# Altium schematic sheet analogPath.SchDoc
size 381 x 203 mm
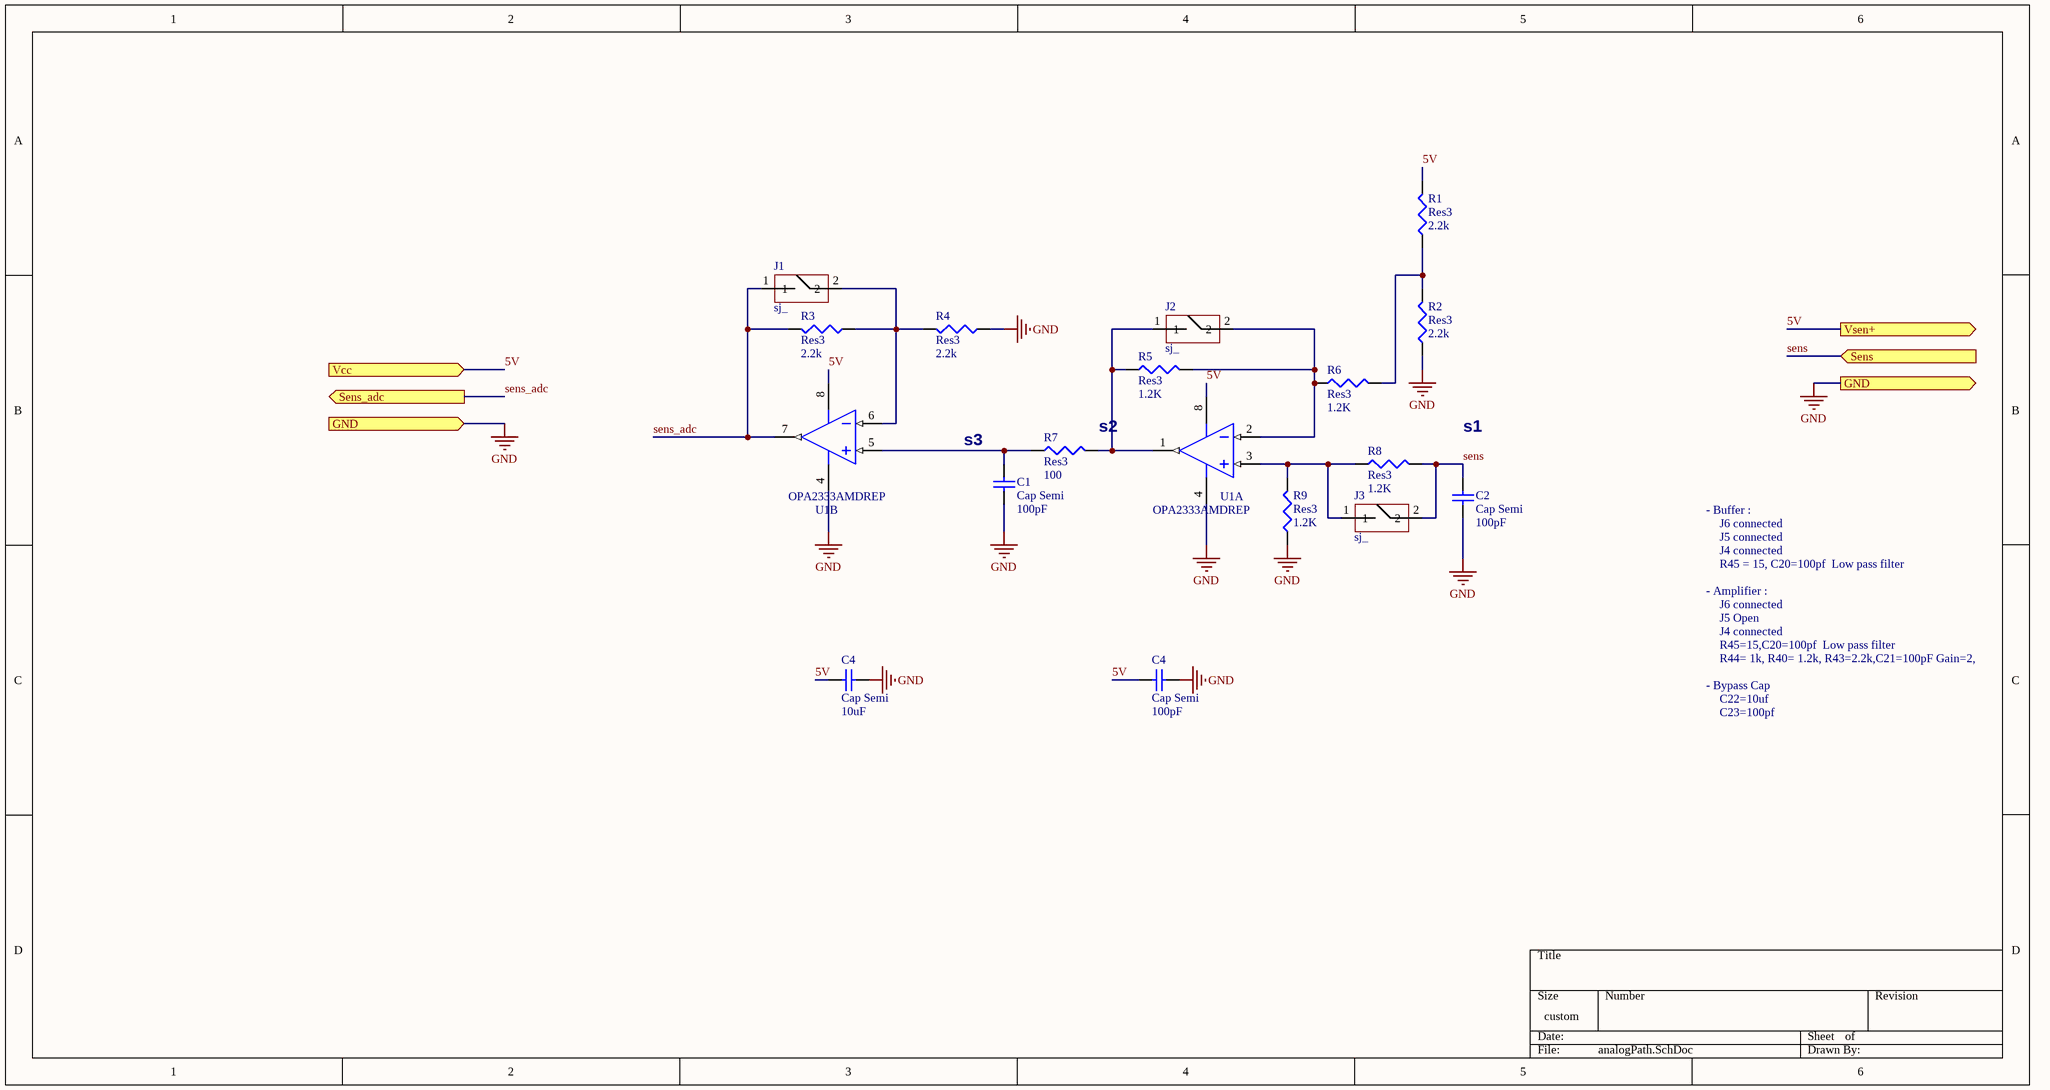
[diagram p0: analogPath.SchDoc]

## Parts
(Parts that share a designator on the sheet are numbered #1, #2 ... from top to bottom, then left to right.)
C1  Cap Semi  value 100pF  [1608[0603]]
C2  Cap Semi  value 100pF  [1608[0603]]
C4#1  Cap Semi  value 100pF  [1608[0603]]
C4#2  Cap Semi  value 10uF  [1608[0603]]
J1  sj_  [JUMPER_NET_TIE]
J2  sj_  [JUMPER_NET_TIE]
J3  sj_  [JUMPER_NET_TIE]
R1  Res3  value 2.2k  [J1-0603]
R2  Res3  value 2.2k  [J1-0603]
R3  Res3  value 2.2k  [J1-0603]
R4  Res3  value 2.2k  [J1-0603]
R5  Res3  value 1.2K  [J1-0603]
R6  Res3  value 1.2K  [J1-0603]
R7  Res3  value 100  [J1-0603]
R8  Res3  value 1.2K  [J1-0603]
R9  Res3  value 1.2K  [J1-0603]
U1  OPA2333AMDREP  [TI-D8_N]  (parts A,B of 2)

## Ports
GND (in), GND (out), Sens (in), Sens_adc (out), Vcc (in), Vsen+ (out)

## Nets
GND: C1.2 C2.2 C4#1.2 C4#2.1 R2.1 R4.1 R9.1 U1.4(V-) ; port GND
5V: C4#1.1 C4#2.2 R1.2 U1.8(V+) ; port Vcc, port Vsen+
sens: C2.1 J3.2 R8.2 ; port Sens
sens_adc: J1.1 R3.2 U1.7(OUT_B) ; port Sens_adc
NetC1_1: C1.1 R7.2 U1.5(IN_B+)
NetJ1_2: J1.2 R3.1 R4.2 U1.6(IN_B-)
NetJ2_1: J2.1 R5.1 R7.1 U1.1(OUT_A)
NetJ2_2: J2.2 R5.2 R6.1 U1.2(IN_A-)
NetJ3_1: J3.1 R8.1 R9.2 U1.3(IN_A+)
NetR1_1: R1.1 R2.2 R6.2

## Notes on the sheet
- (near R7) s2
- s1
- (near C1) s3
- - Buffer :
- J6 connected
- J5 connected
- J4 connected
- R45 = 15, C20=100pf  Low pass filter
- - Amplifier :
- J5 Open
- - Bypass Cap
- R45=15,C20=100pf  Low pass filter
- R44= 1k, R40= 1.2k, R43=2.2k,C21=100pF Gain=2,
- C22=10uf
- C23=100pf

## Library data of the parts
C1 C2 C4#1 C4#2 = Cap Semi: Capacitor (Semiconductor SIM Model); Published: 8-Jun-2000; LatestRevisionDate: 29-May-2009; LatestRevisionNote: IPC-7351 Footprint Added.; PackageReference: C1206; Publisher: Altium Limited; PackageDescription: Chip Capacitor; Supplier 1: Digi-Key
  C1 C2 C4#1: Supplier Part Number 1: 311-3601-1-ND
  C4#2: Supplier Part Number 1: 490-12538-1-ND
J1-J3 = Jumper: solder jumper generic
R1-R9 = Res3: Resistor; Published: 8-Jun-2000; LatestRevisionDate: 29-May-2009; LatestRevisionNote: IPC-7351 Footprint Added.; PackageReference: J1-0603; Publisher: Altium Limited; PackageDescription: Chip Resistor; Supplier 1: Digi-Key
  R1-R4: Supplier Part Number 1: RHM2.2KDCT-ND
  R5 R6 R8 R9: Supplier Part Number 1: RHM1.2KDCT-ND
  R7: Supplier Part Number 1: P120DBCT-ND
U1 = OPA2333AMDREP: Enhanced Product, Micropower CMOS Operational Amplifier Zero-Drift Series, 1.8 to 5.5 V, -55 to 125 degC, 8-pin SOIC (D8), Green (RoHS & no Sb/Br); Manufacturer: Texas Instruments; CMRR(Min)(dB): 102; GBW(Typ)(MHz): 0.35; Iq per channel(Max)(mA): 0.025; Slew Rate(Typ)(V/us): 0.16; Sub Family: General Purpose Amplifier; Total Supply Voltage(Max)(+5V is 5, +/-5V is 10): 5.5; Total Supply Voltage(Min)(+5V is 5, +/-5V is 10): 1.8; DatasheetVersion: SGLS383B; PackageVersion: 4040047-3/M, 06/2011; PackageReference: D8; PackageDescription: 8-Pin Plastic Small Outline, Body 4.9 x 3.9 mm, Pitch 1.27 mm; Supplier 1: Digi-Key; Supplier Part Number 1: 296-22184-2-ND; Supplier 2: Digi-Key; Supplier Part Number 2: 296-22184-1-ND; Supplier 3: Digi-Key; Supplier Part Number 3: 296-22184-6-ND; Supplier 4: Newark; Supplier Part Number 4: 45M9676; Supplier 5: Mouser; Supplier Part Number 5: 595-OPA2333AMDREP; Eco-Plan: Green (RoHS & no Sb/Br); Mounting Technology: Surface Mount; Code_JEDEC: MS-012; PartNumber: OPA2333AMDREP; ComponentLink1Description: Manufacturer URL; ComponentLink1URL: http://www.ti.com/; ComponentLink2Description: Datasheet; ComponentLink2URL: http://www.ti.com/lit/ds/symlink/opa2333a-ep.pdf; ComponentLink3Description: Package Specification; ComponentLink3URL: http://www.ti.com/litv/pdf/msoi002j